# Altium schematic sheet Sheet1.SchDoc
size A; SheetNumber: 1; SheetTotal: 1
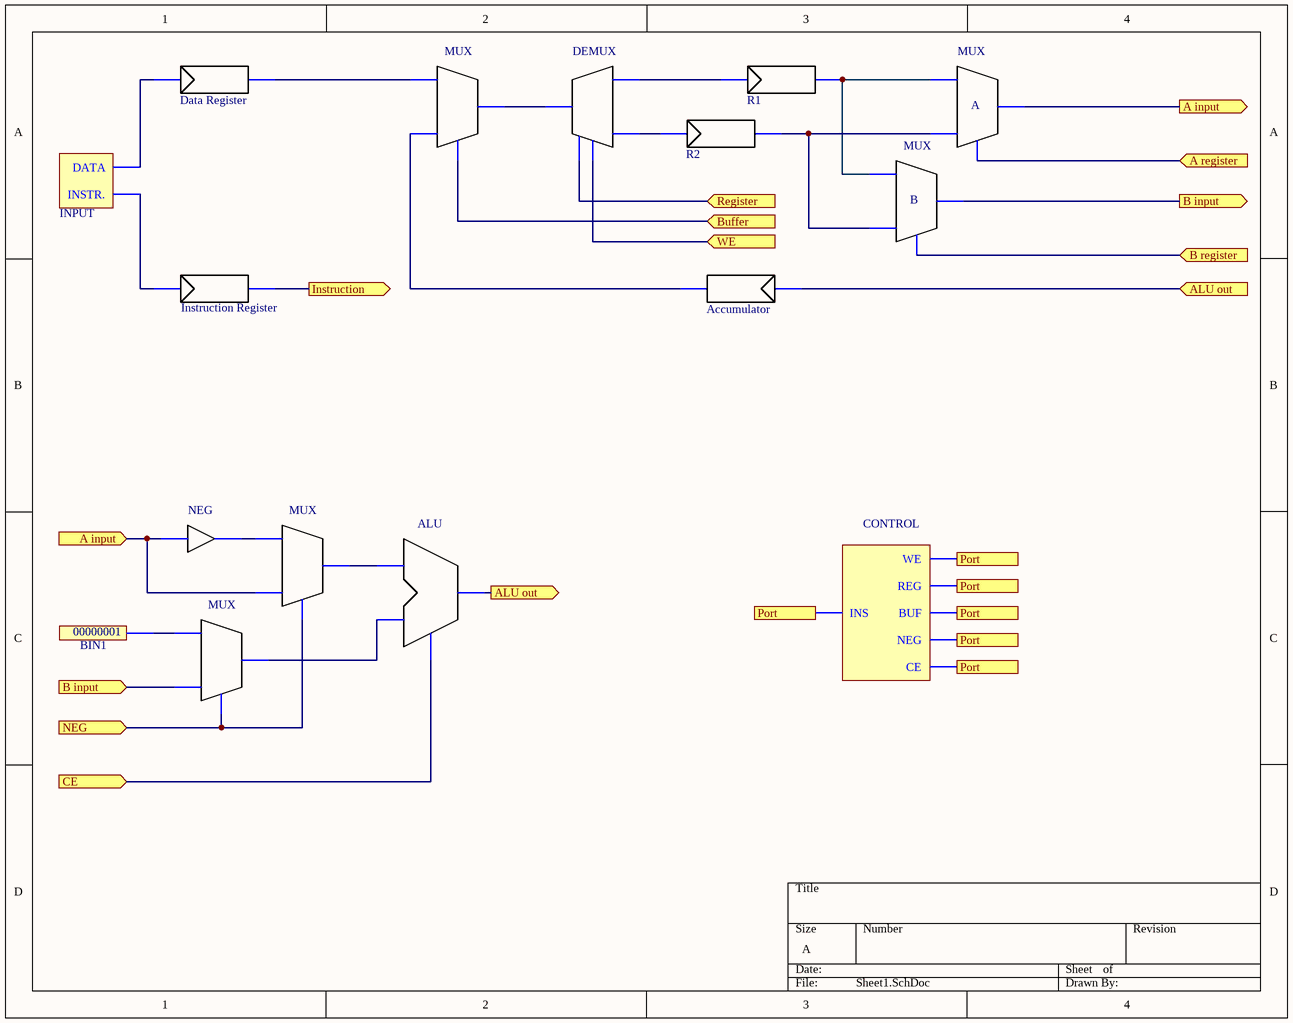
[diagram p0: Sheet1.SchDoc]

## Parts
(Parts that share a designator on the sheet are numbered #1, #2 ... from top to bottom, then left to right.)
?#1  Data Register
?#2  R1
?#3  MUX
?#4  DEMUX
?#5  MUX
?#6  R2
?#7  INPUT
?#8  MUX
?#9  Instruction Register
?#10  Accumulator
?#11  NEG
?#12  MUX
?#13  ALU
?#14  CONTROL
?#15  BIN1
?#16  MUX

## Ports
A input (in), A input (out), A register (in), ALU out (in), ALU out (out), B input (in), B input (out), B register (in), Buffer (in), CE (in), Instruction (out), NEG (in), Port (in), Port (out), Register (in), WE (in)

## Nets
A input: ?#5.?3 ?#11.?2 ?#12.?2 ; port A input
A register: ?#5.?4 ; port A register
ALU out: ?#10.?2 ?#13.?3 ; port ALU out
B input: ?#8.?3 ?#16.?2 ; port B input
B register: ?#8.?4 ; port B register
Buffer: ?#3.?4 ; port Buffer
CE: ?#13.?4 ; port CE
Instruction: ?#9.?1 ; port Instruction
NEG: ?#12.?4 ?#16.?4 ; port NEG
Port: ?#14.?1(INS) ?#14.?2(WE) ?#14.?3(REG) ?#14.?4(BUF) ?#14.?5(NEG) ?#14.?6(CE) ; port Port
Register: ?#4.?5 ; port Register
WE: ?#4.?4 ; port WE
Net?#1_?1: ?#1.?1 ?#3.?1
Net?#1_?2: ?#1.?2 ?#7.?1(DATA)
Net?#2_?1: ?#2.?1 ?#5.?1 ?#8.?1
Net?#2_?2: ?#2.?2 ?#4.?2
Net?#3_?2: ?#3.?2 ?#10.?1
Net?#3_?3: ?#3.?3 ?#4.?3
Net?#4_?1: ?#4.?1 ?#6.?2
Net?#5_?2: ?#5.?2 ?#6.?1 ?#8.?2
Net?#7_?2: ?#7.?2(INSTR.) ?#9.?2
Net?#11_?1: ?#11.?1 ?#12.?1
Net?#12_?3: ?#12.?3 ?#13.?1
Net?#13_?2: ?#13.?2 ?#16.?3
Net?#15_?1: ?#15.?1 ?#16.?1

## Notes on the sheet
- A
- B
- (in symbol BIN1) 00000001

## Library data of the parts
?#1 ?#2 ?#6 ?#9 ?#10 = Register